# EAGLE design untitled (EAGLE 6.4)
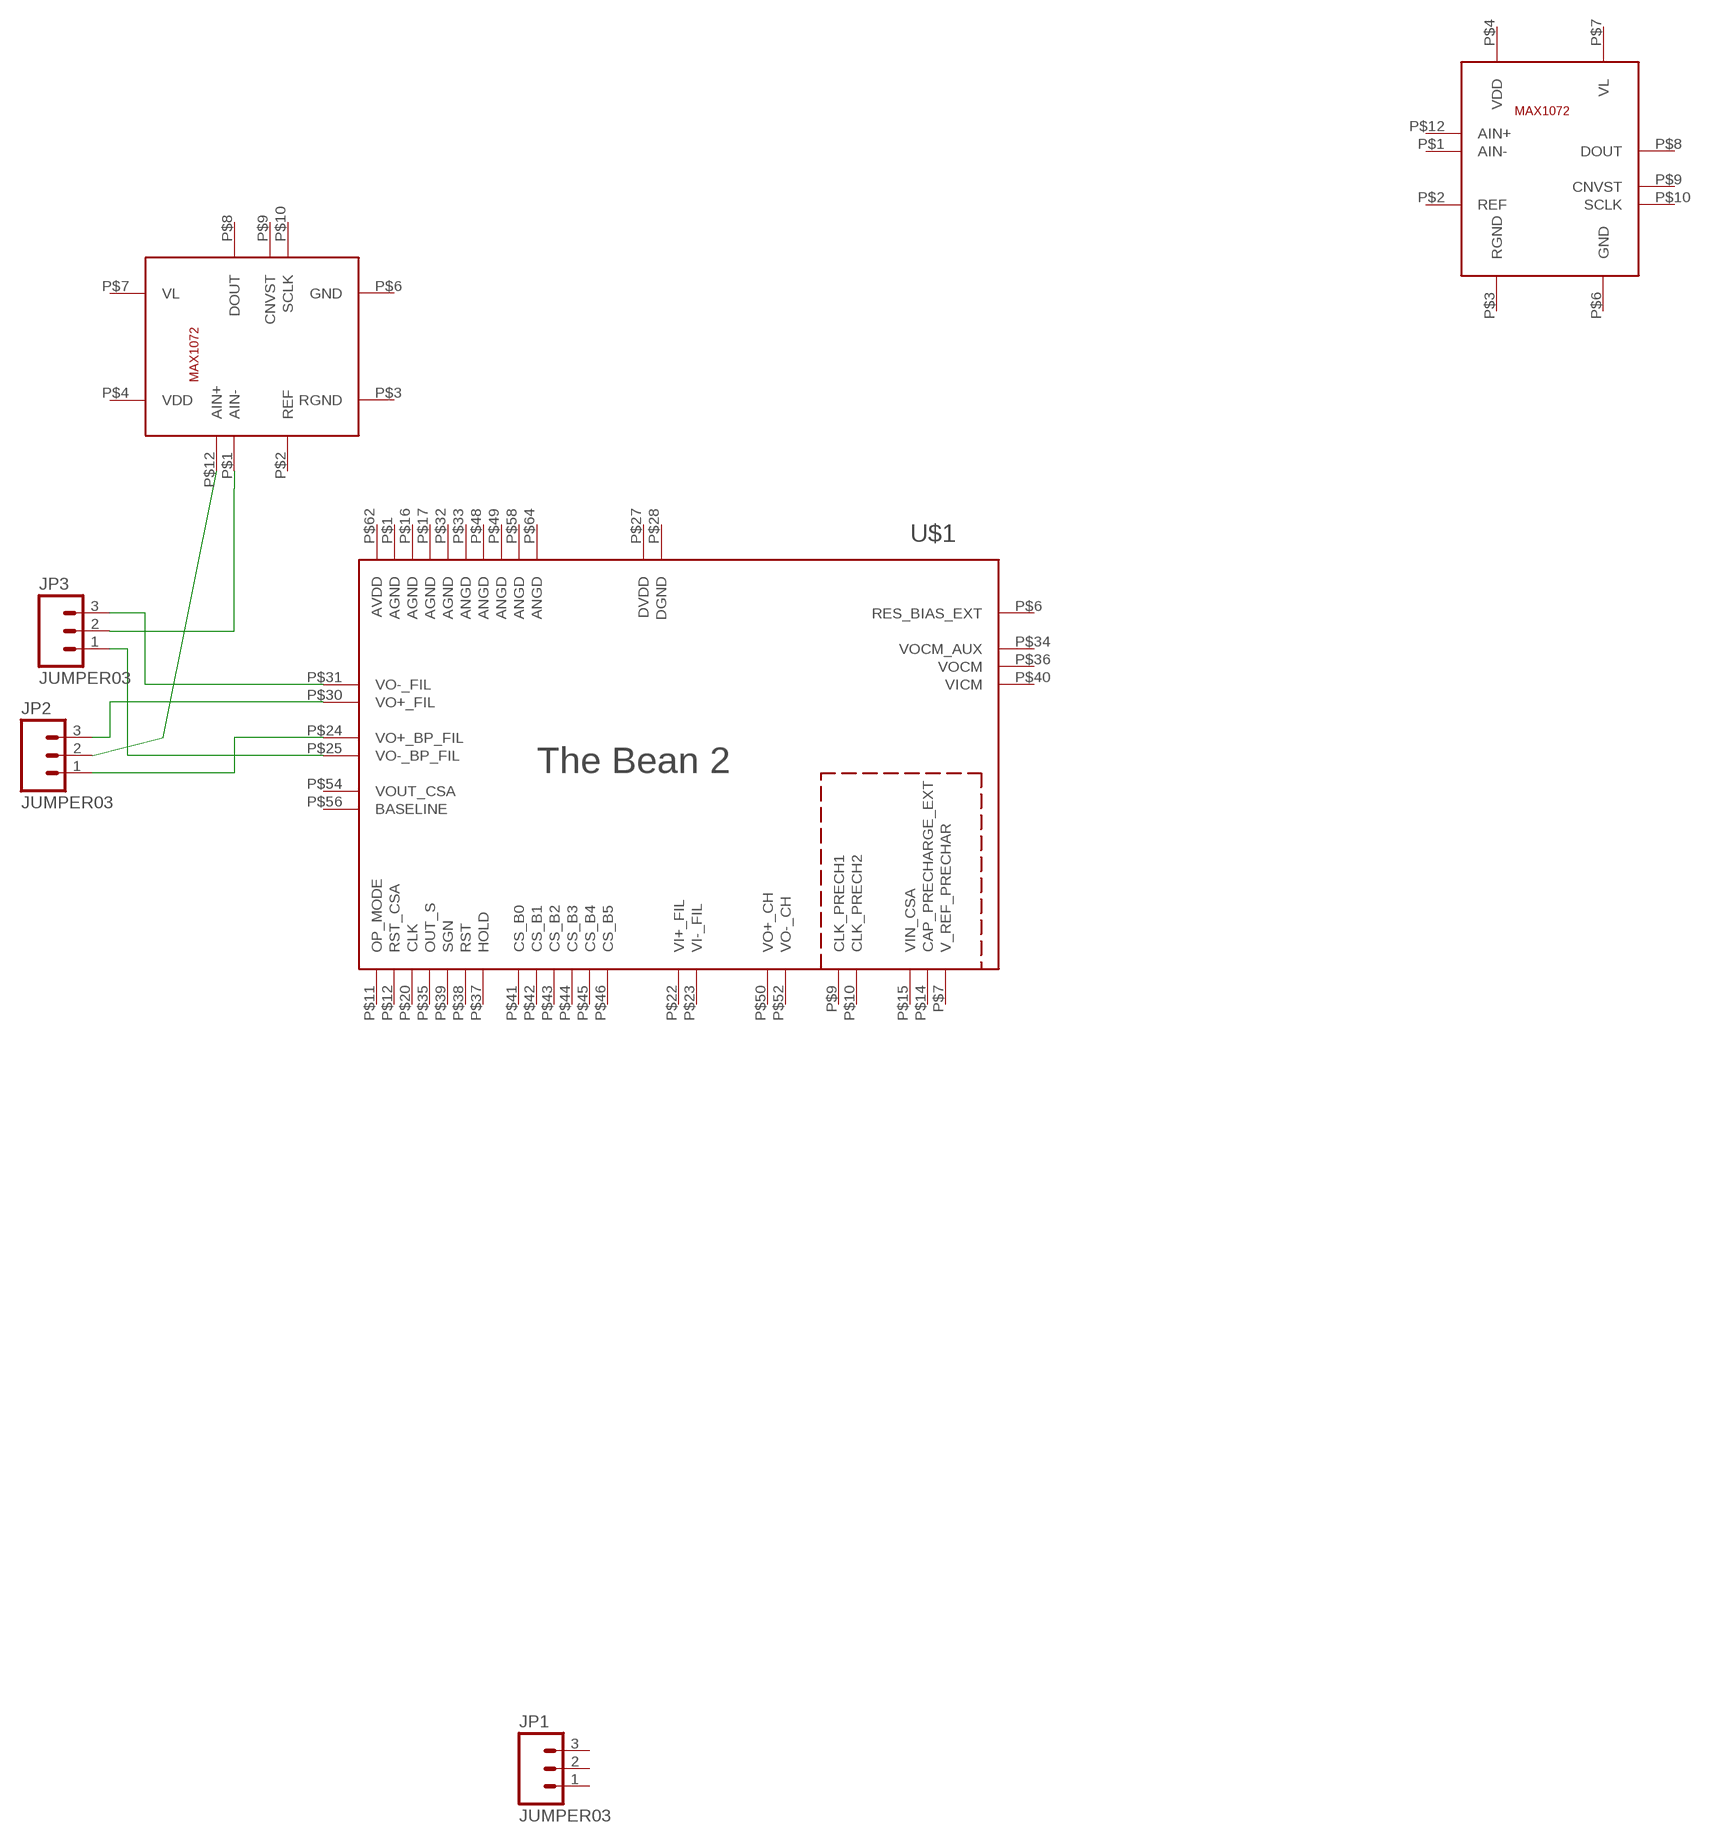
[diagram p0: schematic, sheet 1]

## Parts
JP1  JUMPER03  [1X03]
JP2  JUMPER03  [1X03]
JP3  JUMPER03  [1X03]
U$1  THEBEAN2  [CQFP64]
U$2  MAX1072  [TQFN12]
U$3  MAX1072  [TQFN12]

## Nets
N$1: JP3.3 U$1.P$31(VO-_FIL)
N$2: JP3.1 U$1.P$25(VO-_BP_FIL)
N$3: JP2.3 U$1.P$30(VO+_FIL)
N$4: JP2.1 U$1.P$24(VO+_BP_FIL)
N$5: JP3.2 U$2.P$1(AIN-)
N$6: JP2.2 U$2.P$12(AIN+)
Unconnected: JP1.1 JP1.2 JP1.3 U$1.P$6(RES_BIAS_EXT) U$1.P$7(V_REF_PRECHAR) U$1.P$9(CLK_PRECH1) U$1.P$10(CLK_PRECH2) U$1.P$11(OP_MODE) U$1.P$12(RST_CSA) U$1.P$14(CAP_PRECHARGE_EXT) U$1.P$15(VIN_CSA) U$1.P$20(CLK) U$1.P$22(VI+_FIL) U$1.P$23(VI-_FIL) U$1.P$34(VOCM_AUX) U$1.P$35(OUT_S) U$1.P$36(VOCM) U$1.P$37(HOLD) U$1.P$38(RST) U$1.P$39(SGN) U$1.P$40(VICM) U$1.P$41(CS_B0) U$1.P$42(CS_B1) U$1.P$43(CS_B2) U$1.P$44(CS_B3) U$1.P$45(CS_B4) U$1.P$46(CS_B5) U$1.P$50(VO+_CH) U$1.P$52(VO-_CH) U$1.P$54(VOUT_CSA) U$1.P$56(BASELINE) U$2.P$2(REF) U$2.P$3(RGND) U$2.P$4(VDD) U$2.P$6(GND) U$2.P$7(VL) U$2.P$8(DOUT) U$2.P$9(CNVST) U$2.P$10(SCLK) U$3.P$1(AIN-) U$3.P$2(REF) U$3.P$3(RGND) U$3.P$4(VDD) U$3.P$6(GND) U$3.P$7(VL) U$3.P$8(DOUT) U$3.P$9(CNVST) U$3.P$10(SCLK) U$3.P$12(AIN+)

## Power pins joined to a net without a drawn wire
AGND: U$1.P$1(AGND) U$1.P$16(AGND) U$1.P$17(AGND) U$1.P$32(AGND)
ANGD: U$1.P$33(ANGD) U$1.P$48(ANGD) U$1.P$49(ANGD) U$1.P$58(ANGD) U$1.P$64(ANGD)
AVDD: U$1.P$62(AVDD)
DGND: U$1.P$28(DGND)
DVDD: U$1.P$27(DVDD)

## Library data of the parts
JP1-JP3 = wac:JUMPER03
U$1 = wac:THEBEAN2: Nuvo modelo del chip, mantiene las mismas conexiones pero se cambio el package CQFP64
U$2 U$3 = wac:MAX1072

## Board
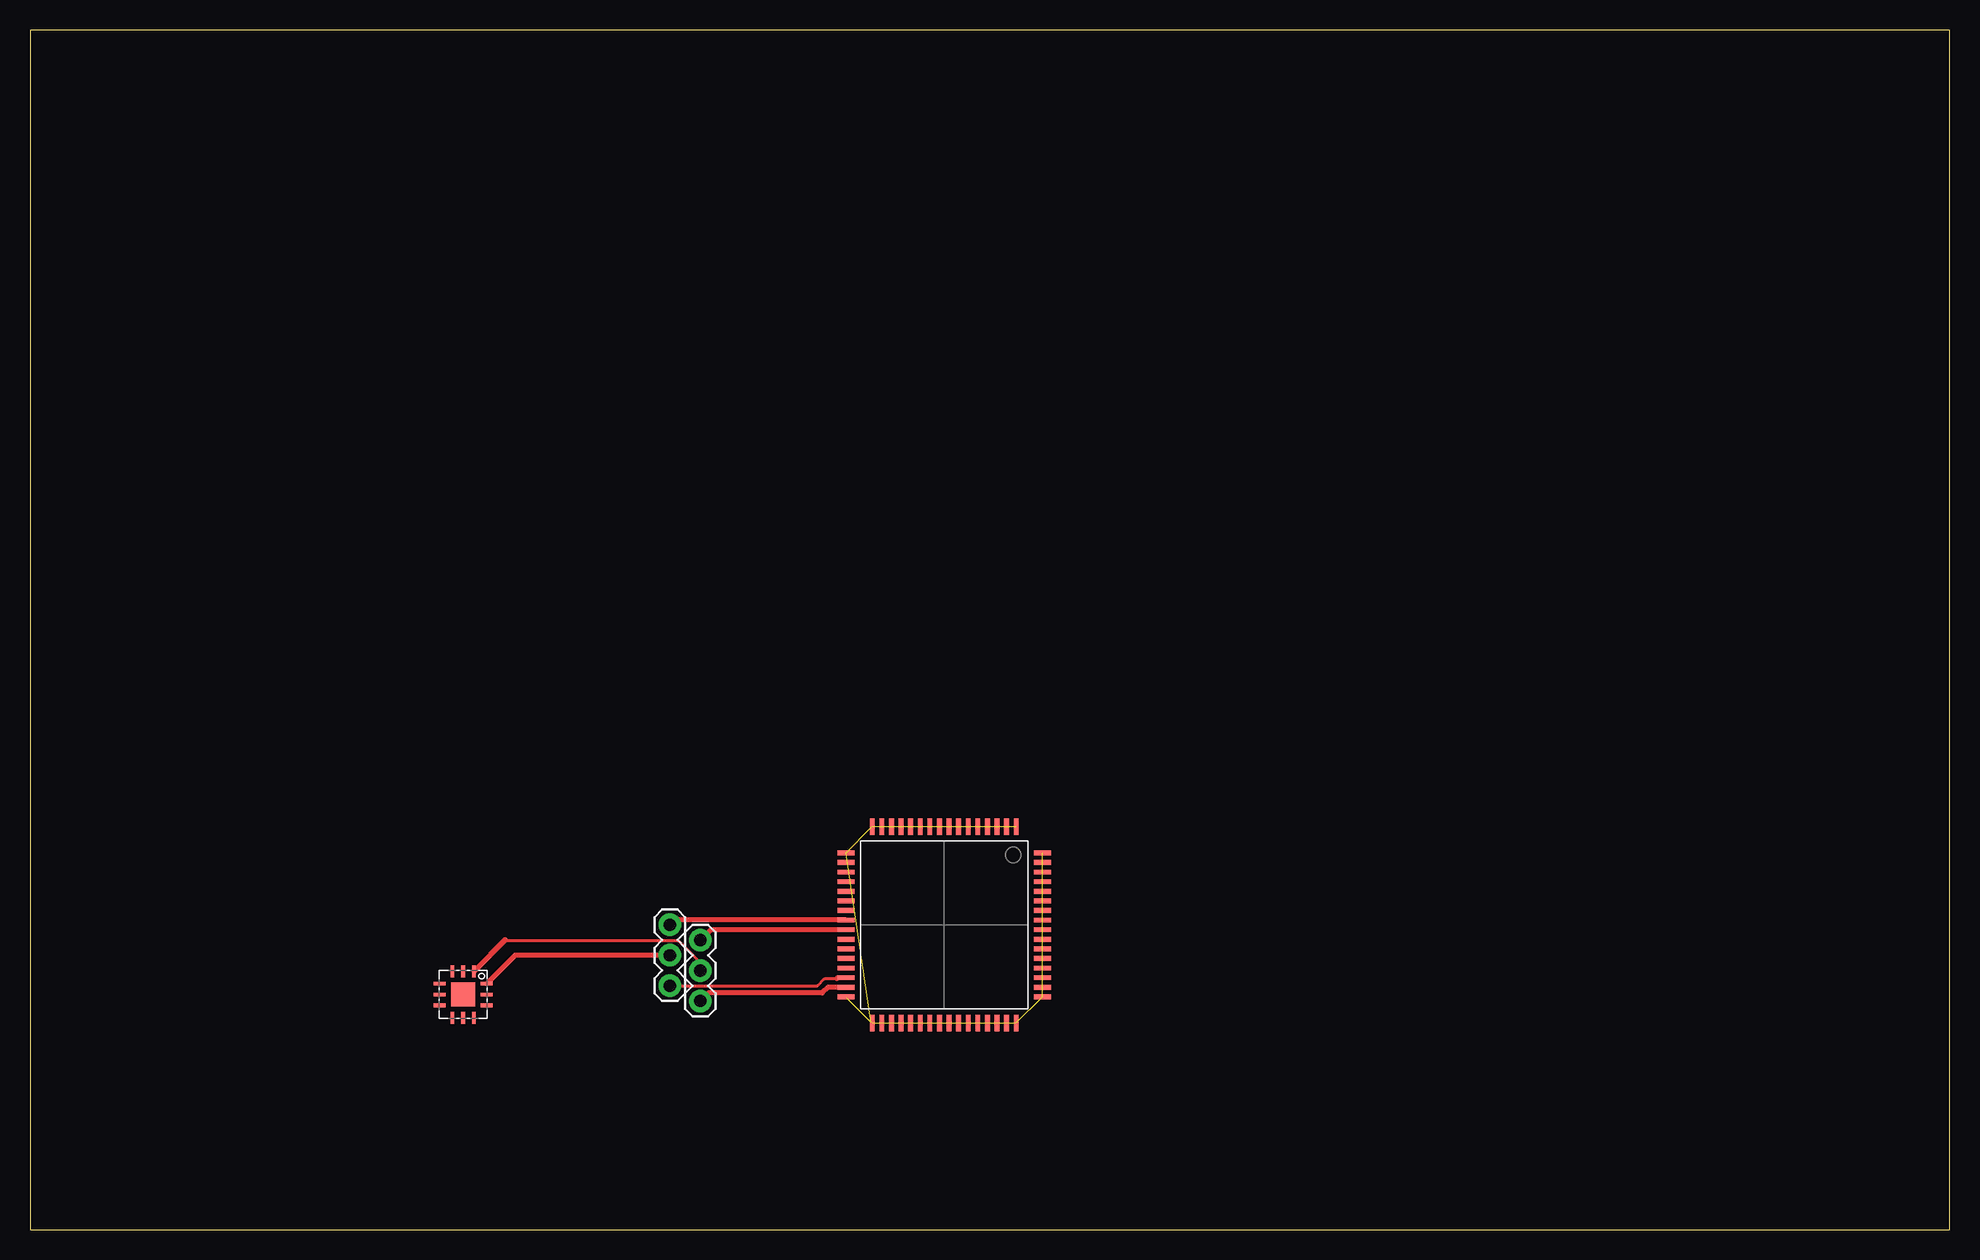
[diagram p1: board, top side]

Size 160 x 100 mm. Coordinates in mm from the lower left corner, seen from the top.
Outline: 0,0 160,0 160,100 0,100 0,0
Copper layers [2:(1*2*3*16):3]: Top 0.035mm / dielectric 1.5mm / Route2 0.035mm / dielectric 0.15mm / Route3 0.035mm / dielectric 0.2mm / Bottom 0.035mm
Design rules "ITEADstudio_DRC": minimum track width 6mil, minimum drill 12mil, track to track 6mil, track to pad 6mil, pad to pad 6mil, via to via 6mil, smd to smd 0mil, copper to edge 10mil, drill to drill 10mil, minimum pad ring 10mil, minimum via ring 6mil, stop-mask expansion 2mil, vias tented up to drill 100mil, thermal gap 10mil

### Footprints (pad centres in the part's own frame; a part is rotated, then mirrored left to right if it is on the bottom)
1X03 = drill 1.016 pad 1.88: 1 -2.54,0; 2 0,0; 3 2.54,0
CQFP64 = smd 0.4 x 1.4: P$1 -6,-8.185; P$2 -5.2,-8.185; P$3 -4.4,-8.185; P$4 -3.6,-8.185; P$5 -2.8,-8.185; P$6 -2,-8.185; P$7 -1.2,-8.185; P$8 -0.4,-8.185; P$9 0.4,-8.185; P$10 1.2,-8.185; P$11 2,-8.185; P$12 2.8,-8.185; P$13 3.6,-8.185; P$14 4.4,-8.185; P$15 5.2,-8.185; P$16 6,-8.185; P$33 6,8.185; P$34 5.2,8.185; P$35 4.4,8.185; P$36 3.6,8.185; P$37 2.8,8.185; P$38 2,8.185; P$39 1.2,8.185; P$40 0.4,8.185; P$41 -0.4,8.185; P$42 -1.2,8.185; P$43 -2,8.185; P$44 -2.8,8.185; P$45 -3.6,8.185; P$46 -4.4,8.185; P$47 -5.2,8.185; P$48 -6,8.185 | smd 1.4 x 0.4: P$17 8.185,-6; P$18 8.185,-5.2; P$19 8.185,-4.4; P$20 8.185,-3.6; P$21 8.185,-2.8; P$22 8.185,-2; P$23 8.185,-1.2; P$24 8.185,-0.4; P$25 8.185,0.4; P$26 8.185,1.2; P$27 8.185,2; P$28 8.185,2.8; P$29 8.185,3.6; P$30 8.185,4.4; P$31 8.185,5.2; P$32 8.185,6; P$49 -8.185,6; P$50 -8.185,5.2; P$51 -8.185,4.4; P$52 -8.185,3.6; P$53 -8.185,2.8; P$54 -8.185,2; P$55 -8.185,1.2; P$56 -8.185,0.4; P$57 -8.185,-0.4; P$58 -8.185,-1.2; P$59 -8.185,-2; P$60 -8.185,-2.8; P$61 -8.185,-3.6; P$62 -8.185,-4.4; P$63 -8.185,-5.2; P$64 -8.185,-6
TQFN12 = smd 1 x 0.3: P$1 0.05,-1.1; P$2 0.05,-2; P$3 0.05,-2.9; P$7 3.95,-2.9; P$8 3.95,-2; P$9 3.95,-1.1 | smd 0.3 x 1: P$4 1.1,-3.95; P$5 2,-3.95; P$6 2.9,-3.95; P$10 2.9,-0.05; P$11 2,-0.05; P$12 1.1,-0.05 | smd 2 x 2: P$13 2,-2

### Placement (x,y rotation side)
JP1  -29.21,21.59 0 top  (outside the outline)
JP2  53.34,22.86 270 top
JP3  55.88,21.59 270 top
U$1  76.2,25.4 180 top
U$2  38.1,21.59 270 top
U$3  -24.13,24.13 0 top  (outside the outline)

### Tracks (layer width: path | path; a pad name or v marks a point on that pad's centre or on a via)
AGND  (4 unrouted)
  Top 0.406: U$1.P$32 68.02,19.36
ANGD  (4 unrouted)
N$1
  Top 0.406: U$1.P$31 66.53,20.2 66.04,19.71 56.54,19.71 JP3.3
N$2
  Top 0.406: U$1.P$25 56.75,25 JP3.1
N$3
  Top 0.254: JP2.3 65.63,20.32 66.24,20.93 67.26,20.93
  Top 0.406: U$1.P$30 67.33,21 67.26,20.93
N$4
  Top 0.406: U$1.P$24 53.74,25.8 JP2.1
N$5
  Top 0.254: 55.88,22.35 55.78,22.35 54.05,24.08 39.74,24.08 39.64,24.18
  Top 0.406: JP3.2 55.88,22.35 | 39.64,24.18 U$2.P$1
N$6
  Top 0.406: JP2.2 40.42,22.86 U$2.P$12